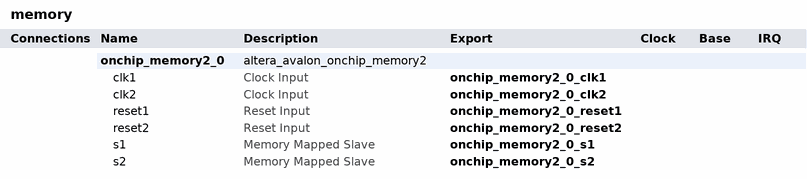
[diagram p0: system contents]
# Platform Designer (Qsys) system memory, Cyclone IV E EP4CE10E22A7
# Parameters at their usual value, and those the tool derives, are not listed.
package require -exact qsys 16.1
create_system memory
set_project_property DEVICE_FAMILY {Cyclone IV E}
set_project_property DEVICE EP4CE10E22A7

add_instance onchip_memory2_0 altera_avalon_onchip_memory2 16.1
set_instance_parameter_value onchip_memory2_0 dataWidth 32
set_instance_parameter_value onchip_memory2_0 dualPort true
set_instance_parameter_value onchip_memory2_0 initMemContent true
set_instance_parameter_value onchip_memory2_0 initializationFileName onchip_mem.hex
set_instance_parameter_value onchip_memory2_0 memorySize 4096

# exported interfaces
add_interface onchip_memory2_0_clk1 clock sink
set_interface_property onchip_memory2_0_clk1 EXPORT_OF onchip_memory2_0.clk1
add_interface onchip_memory2_0_clk2 clock sink
set_interface_property onchip_memory2_0_clk2 EXPORT_OF onchip_memory2_0.clk2
add_interface onchip_memory2_0_reset1 reset sink
set_interface_property onchip_memory2_0_reset1 EXPORT_OF onchip_memory2_0.reset1
add_interface onchip_memory2_0_reset2 reset sink
set_interface_property onchip_memory2_0_reset2 EXPORT_OF onchip_memory2_0.reset2
add_interface onchip_memory2_0_s1 avalon slave
set_interface_property onchip_memory2_0_s1 EXPORT_OF onchip_memory2_0.s1
add_interface onchip_memory2_0_s2 avalon slave
set_interface_property onchip_memory2_0_s2 EXPORT_OF onchip_memory2_0.s2

set_interconnect_requirement {$system} qsys_mm.clockCrossingAdapter HANDSHAKE
set_interconnect_requirement {$system} qsys_mm.enableEccProtection FALSE
set_interconnect_requirement {$system} qsys_mm.insertDefaultSlave FALSE
set_interconnect_requirement {$system} qsys_mm.maxAdditionalLatency 1

save_system memory.qsys
